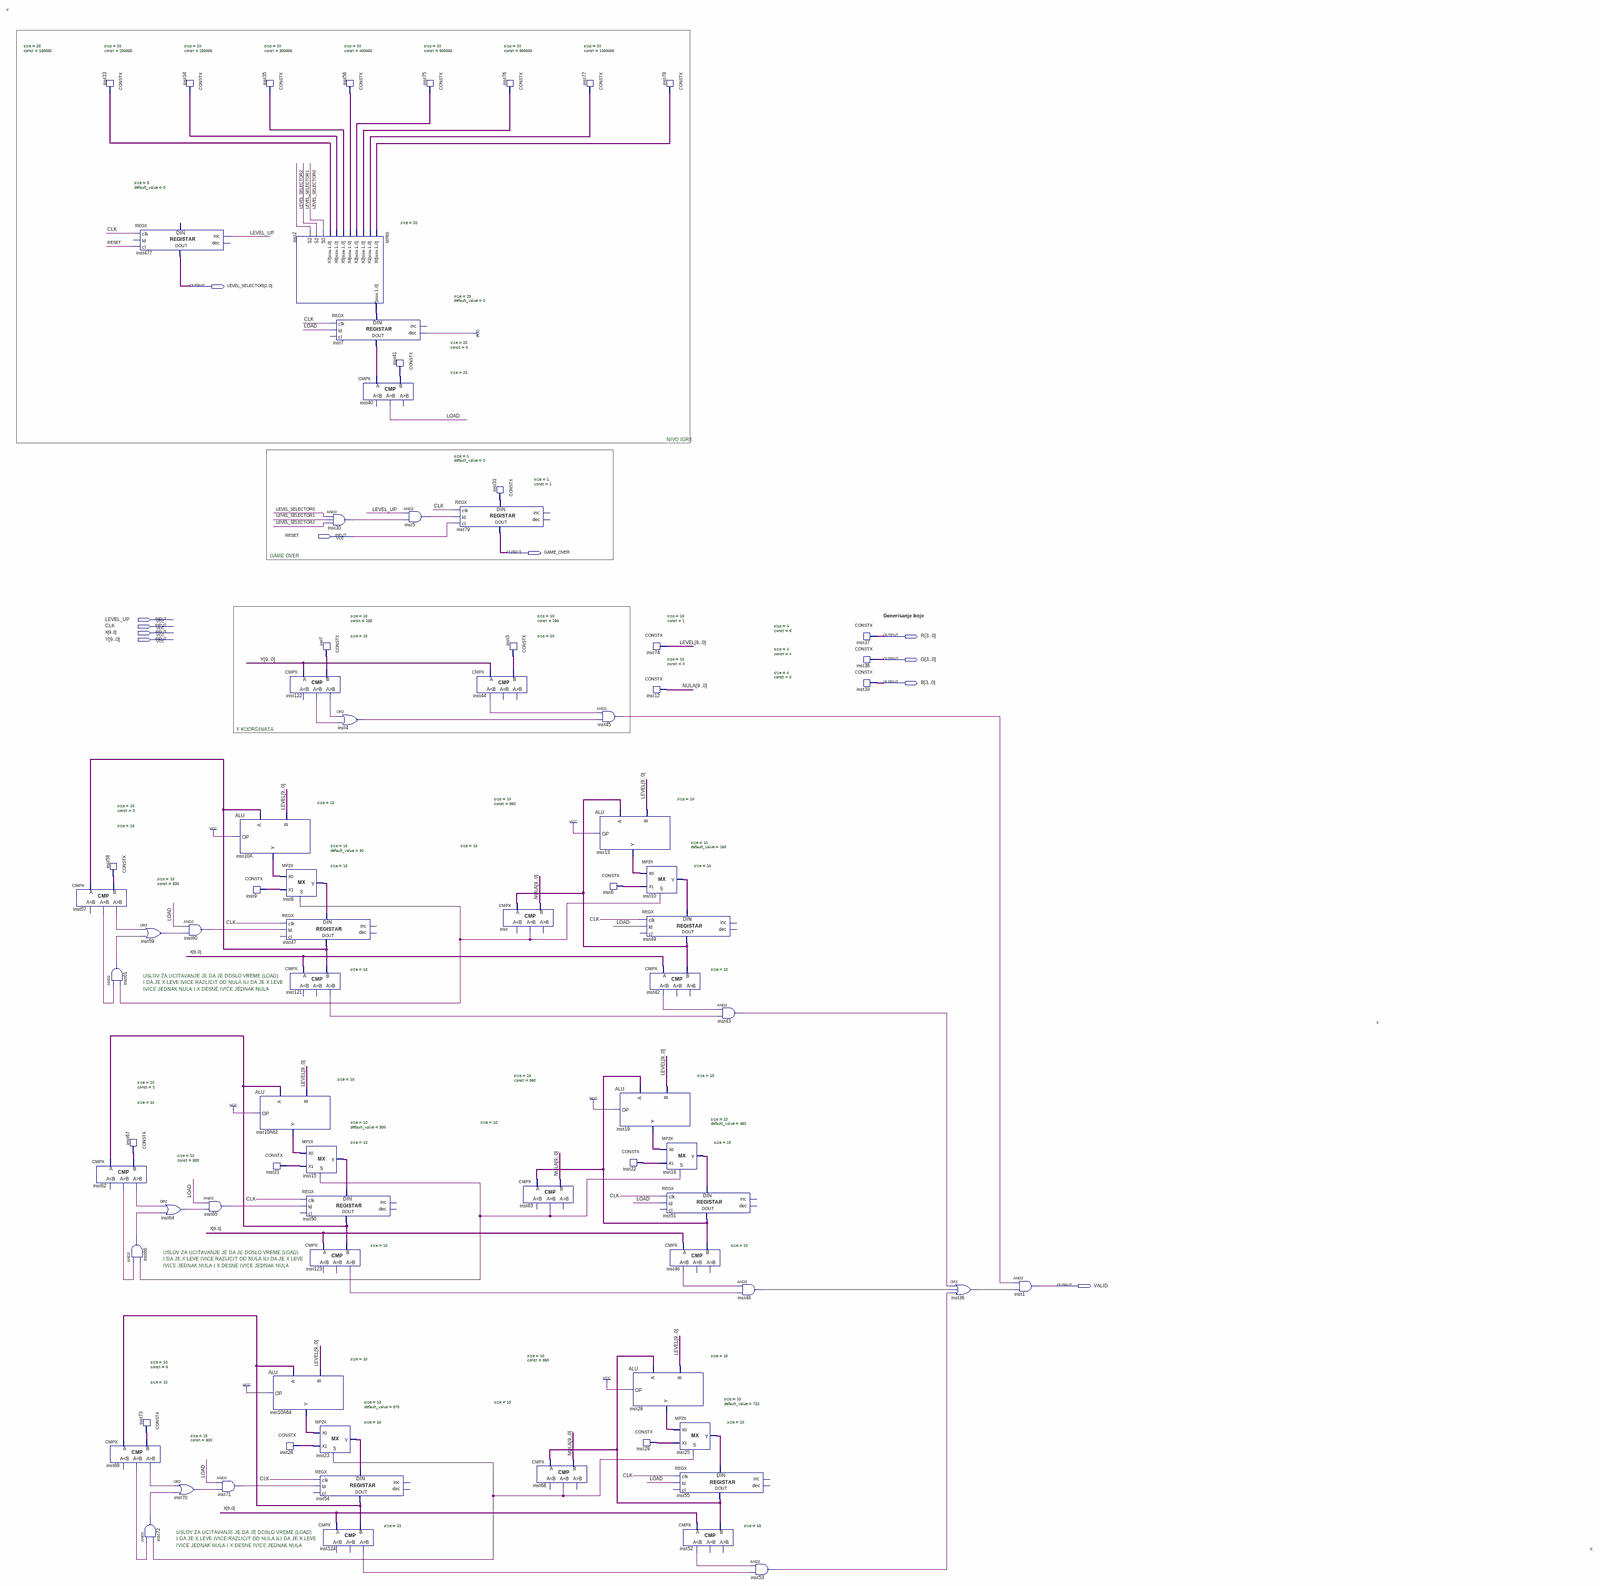
[diagram p0: schematic sheet, whole]
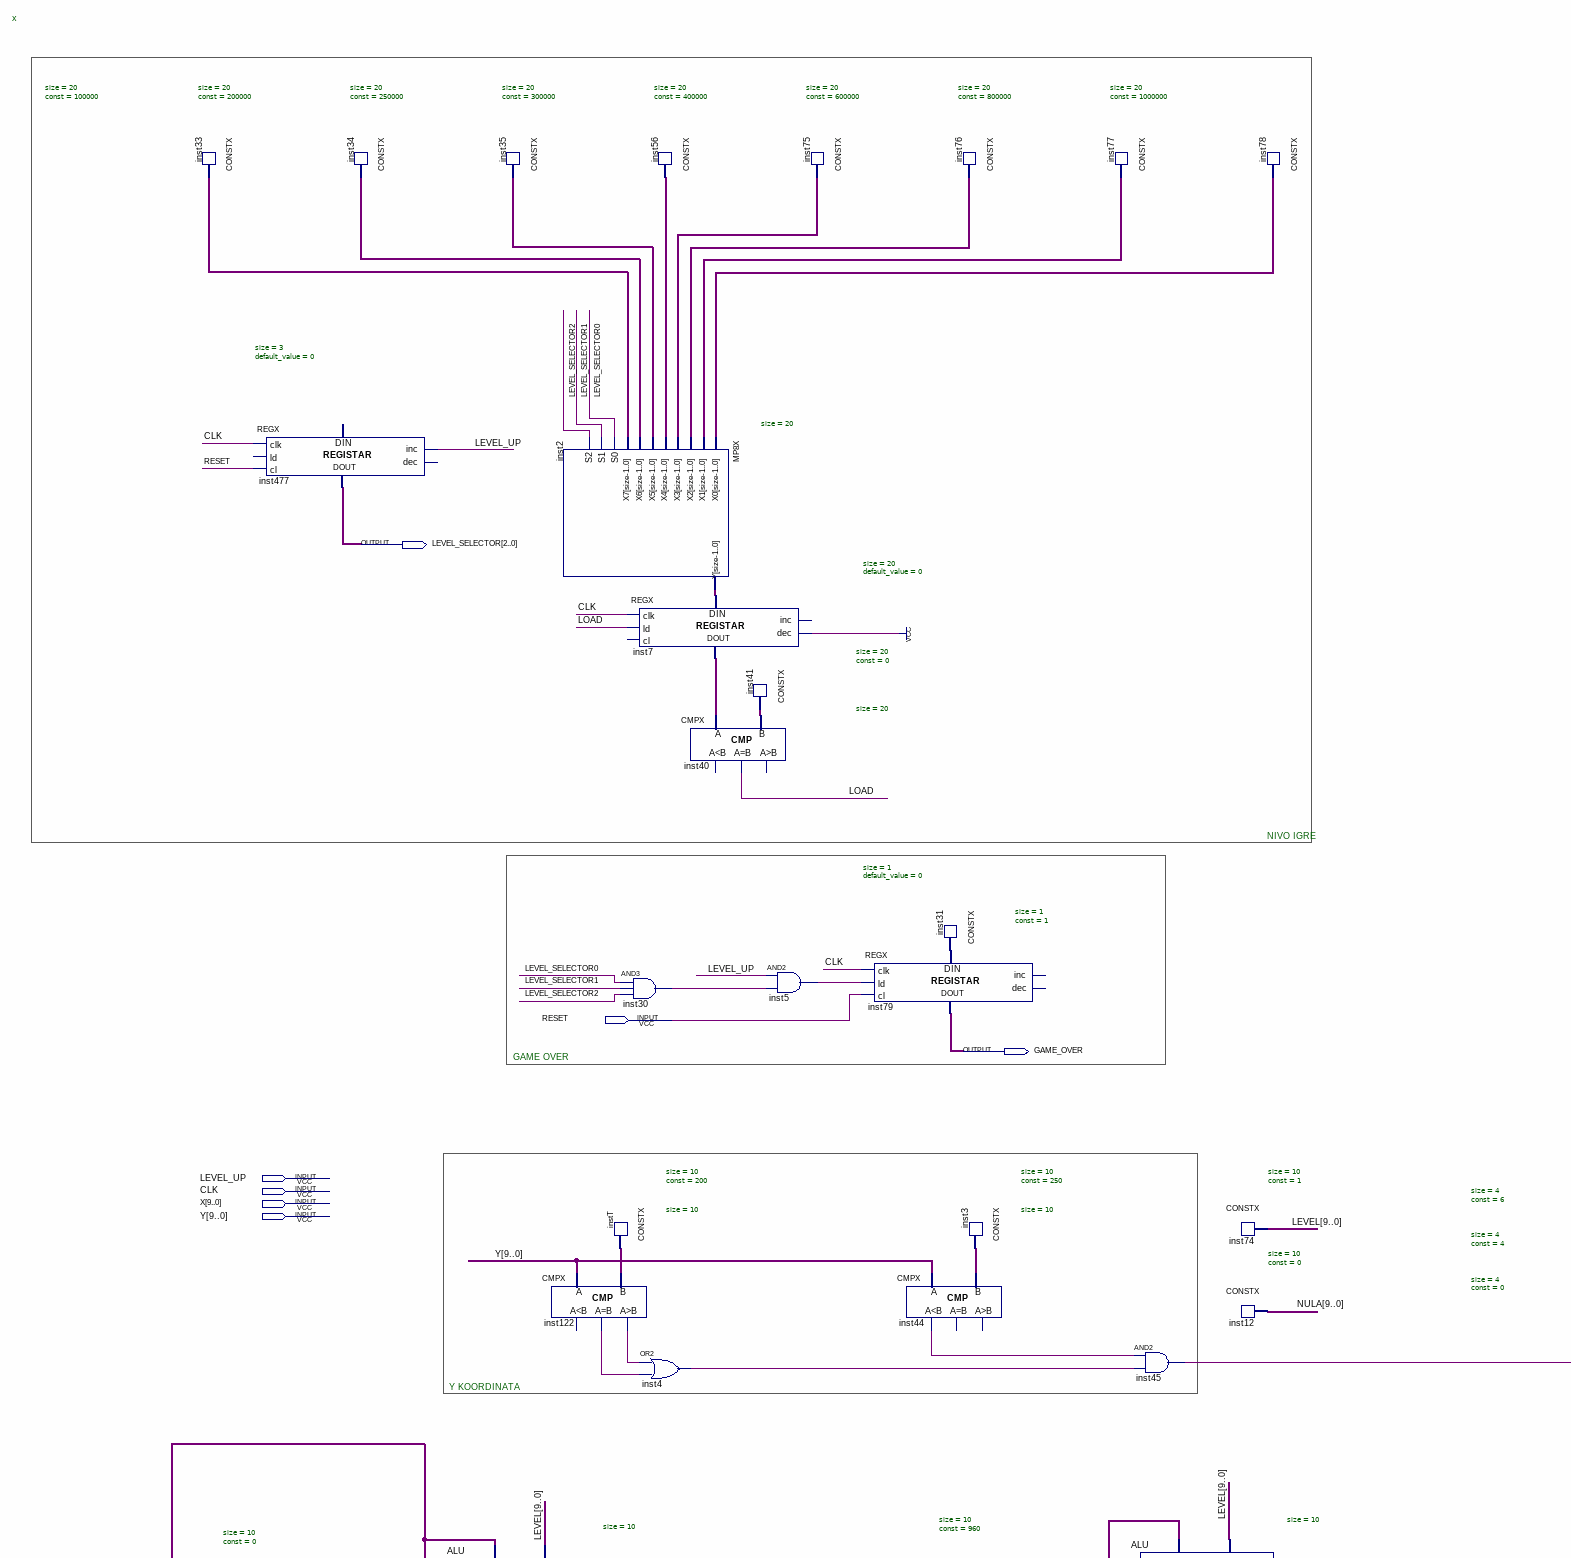
[diagram p1: schematic sheet, upper left part]
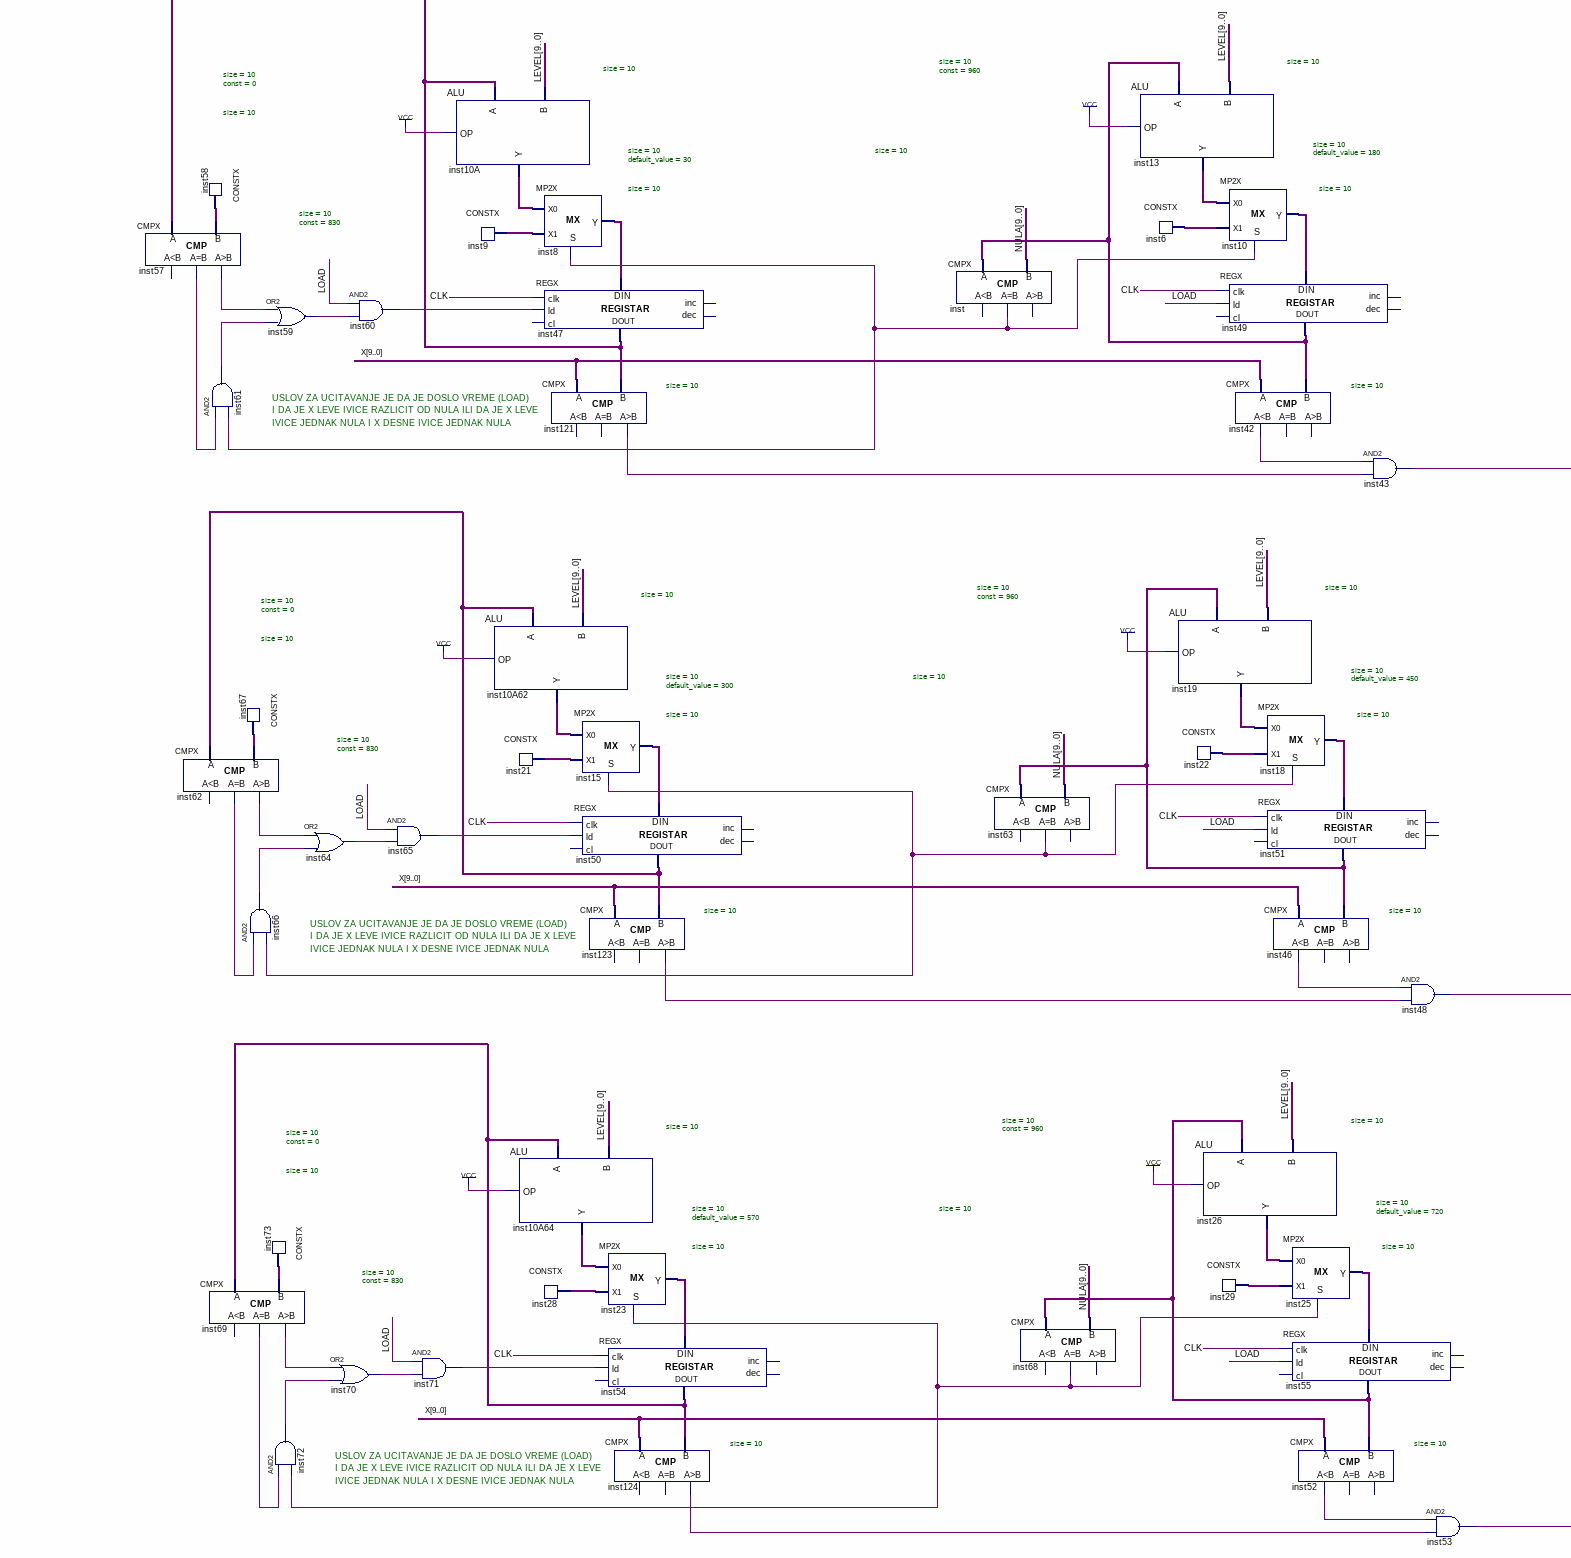
[diagram p2: schematic sheet, lower left part]
// Quartus schematic Layer_Road.bdf as structural Verilog: 81 symbols, 11 pins
module Layer_Road (
  input  RESET,
  input  LEVEL_UP,
  input  CLK,
  input  [9:0] X,
  input  [9:0] Y,
  output [2:0] LEVEL_SELECTOR,
  output GAME_OVER,
  output [3:0] R,
  output [3:0] G,
  output [3:0] B,
  output VALID
);

  wire inst4_out, inst5_out, inst30_out, inst31_data, inst36_out, inst42_ls, inst43_out, inst44_ls,
       inst45_out, inst46_ls, inst48_out, inst52_ls, inst53_out, inst57_eq, inst57_gr, inst59_out,
       inst60_out, inst61_out, inst62_eq, inst62_gr, inst63_eq, inst64_out, inst65_out, inst66_out,
       inst68_eq, inst69_eq, inst69_gr, inst70_out, inst71_out, inst72_out, inst121_gr, inst122_eq,
       inst122_gr, inst123_gr, inst124_gr, inst_eq, LOAD;
  wire [9:0] inst3_data, inst6_data, inst8_y, inst9_data, inst10_y, inst10A62_result, inst10A64_result,
       inst10A_result, inst13_result, inst15_y, inst18_y, inst19_result, inst21_data, inst22_data, inst23_y,
       inst25_y, inst26_result, inst28_data, inst29_data, inst47_data_out, inst49_data_out, inst50_data_out,
       inst51_data_out, inst54_data_out, inst55_data_out, inst58_data, inst67_data, inst73_data, instT_data,
       LEVEL, NULA;
  wire [19:0] inst2_y, inst7_data_out, inst33_data, inst34_data, inst35_data, inst41_data, inst56_data,
       inst75_data, inst76_data, inst77_data, inst78_data;

  CMPX #(.size(10)) inst57 (.A(inst47_data_out), .B(inst58_data), .eq(inst57_eq), .gr(inst57_gr));  // open: ls
  CONSTX #(.size(20), .\const (100000)) inst33 (.data(inst33_data));
  CONSTX #(.size(10), .\const (0)) inst58 (.data(inst58_data));
  CMPX #(.size(10)) inst62 (.A(inst50_data_out), .B(inst67_data), .eq(inst62_eq), .gr(inst62_gr));  // open: ls
  CMPX #(.size(10)) inst69 (.A(inst54_data_out), .B(inst73_data), .eq(inst69_eq), .gr(inst69_gr));  // open: ls
  and inst61 (inst61_out, inst57_eq, inst_eq);
  CONSTX #(.size(10), .\const (0)) inst67 (.data(inst67_data));
  and inst66 (inst66_out, inst62_eq, inst63_eq);
  REGX #(.size(3), .default_value(0)) inst477 (
    .clk(CLK), .cl(RESET), .inc(LEVEL_UP), .data_out(LEVEL_SELECTOR));  // open: ld, dec, data_in
  or inst59 (inst59_out, inst57_gr, inst61_out);
  CONSTX #(.size(10), .\const (0)) inst73 (.data(inst73_data));
  and inst72 (inst72_out, inst69_eq, inst68_eq);
  CONSTX #(.size(20), .\const (200000)) inst34 (.data(inst34_data));
  and inst60 (inst60_out, LOAD, inst59_out);
  or inst64 (inst64_out, inst62_gr, inst66_out);
  or inst70 (inst70_out, inst69_gr, inst72_out);
  and inst65 (inst65_out, LOAD, inst64_out);
  ALU #(.size(10)) inst10A (.op(1'b1), .a(inst47_data_out), .b(LEVEL), .result(inst10A_result));
  and inst71 (inst71_out, LOAD, inst70_out);
  CONSTX #(.size(20), .\const (250000)) inst35 (.data(inst35_data));
  CONSTX #(.size(10), .\const (830)) inst9 (.data(inst9_data));
  ALU #(.size(10)) inst10A62 (.op(1'b1), .a(inst50_data_out), .b(LEVEL), .result(inst10A62_result));
  CONSTX #(.size(10), .\const (830)) inst21 (.data(inst21_data));
  MP8X #(.size(20)) inst2 (
    .X0(inst78_data), .X1(inst77_data), .X2(inst76_data), .X3(inst75_data), .X4(inst56_data),
    .X5(inst35_data), .X6(inst34_data), .X7(inst33_data), .S0(LEVEL_SELECTOR[0]), .S1(LEVEL_SELECTOR[1]),
    .S2(LEVEL_SELECTOR[2]), .Y(inst2_y));
  CMPX #(.size(10)) inst122 (.A(Y), .B(instT_data), .eq(inst122_eq), .gr(inst122_gr));  // open: ls
  MP2X #(.size(10)) inst8 (.S(inst_eq), .X0(inst10A_result), .X1(inst9_data), .Y(inst8_y));
  REGX #(.size(10), .default_value(30)) inst47 (
    .clk(CLK), .ld(inst60_out), .data_in(inst8_y), .data_out(inst47_data_out));  // open: cl, inc, dec
  CMPX #(.size(10)) inst121 (.A(X), .B(inst47_data_out), .gr(inst121_gr));  // open: ls, eq
  ALU #(.size(10)) inst10A64 (.op(1'b1), .a(inst54_data_out), .b(LEVEL), .result(inst10A64_result));
  CONSTX #(.size(10), .\const (830)) inst28 (.data(inst28_data));
  CONSTX #(.size(10), .\const (200)) instT (.data(instT_data));
  MP2X #(.size(10)) inst15 (.S(inst63_eq), .X0(inst10A62_result), .X1(inst21_data), .Y(inst15_y));
  REGX #(.size(10), .default_value(300)) inst50 (
    .clk(CLK), .ld(inst65_out), .data_in(inst15_y), .data_out(inst50_data_out));  // open: cl, inc, dec
  CMPX #(.size(10)) inst123 (.A(X), .B(inst50_data_out), .gr(inst123_gr));  // open: ls, eq
  MP2X #(.size(10)) inst23 (.S(inst68_eq), .X0(inst10A64_result), .X1(inst28_data), .Y(inst23_y));
  REGX #(.size(10), .default_value(570)) inst54 (
    .clk(CLK), .ld(inst71_out), .data_in(inst23_y), .data_out(inst54_data_out));  // open: cl, inc, dec
  CMPX #(.size(10)) inst124 (.A(X), .B(inst54_data_out), .gr(inst124_gr));  // open: ls, eq
  CONSTX #(.size(20), .\const (300000)) inst56 (.data(inst56_data));
  REGX #(.size(20), .default_value(0)) inst7 (
    .clk(CLK), .ld(LOAD), .dec(1'b1), .data_in(inst2_y), .data_out(inst7_data_out));  // open: cl, inc
  and inst30 (inst30_out, LEVEL_SELECTOR[0], LEVEL_SELECTOR[1], LEVEL_SELECTOR[2]);
  or inst4 (inst4_out, inst122_gr, inst122_eq);
  CMPX #(.size(20)) inst40 (.A(inst7_data_out), .B(inst41_data), .eq(LOAD));  // open: ls, gr
  CONSTX #(.size(20), .\const (0)) inst41 (.data(inst41_data));
  CONSTX #(.size(20), .\const (400000)) inst75 (.data(inst75_data));
  and inst5 (inst5_out, LEVEL_UP, inst30_out);
  REGX #(.size(1), .default_value(0)) inst79 (
    .clk(CLK), .ld(inst5_out), .cl(RESET), .data_in(inst31_data), .data_out(GAME_OVER));  // open: inc, dec
  CMPX #(.size(10)) inst44 (.A(Y), .B(inst3_data), .ls(inst44_ls));  // open: eq, gr
  CONSTX #(.size(20), .\const (600000)) inst76 (.data(inst76_data));
  CONSTX #(.size(1), .\const (1)) inst31 (.data(inst31_data));
  CONSTX #(.size(10), .\const (250)) inst3 (.data(inst3_data));
  CMPX #(.size(10)) inst (.A(inst49_data_out), .B(NULA), .eq(inst_eq));  // open: ls, gr
  CMPX #(.size(10)) inst63 (.A(inst51_data_out), .B(NULA), .eq(inst63_eq));  // open: ls, gr
  CMPX #(.size(10)) inst68 (.A(inst55_data_out), .B(NULA), .eq(inst68_eq));  // open: ls, gr
  CONSTX #(.size(20), .\const (800000)) inst77 (.data(inst77_data));
  and inst45 (inst45_out, inst44_ls, inst4_out);
  ALU #(.size(10)) inst13 (.op(1'b1), .a(inst49_data_out), .b(LEVEL), .result(inst13_result));
  CONSTX #(.size(10), .\const (960)) inst6 (.data(inst6_data));
  ALU #(.size(10)) inst19 (.op(1'b1), .a(inst51_data_out), .b(LEVEL), .result(inst19_result));
  CONSTX #(.size(10), .\const (960)) inst22 (.data(inst22_data));
  ALU #(.size(10)) inst26 (.op(1'b1), .a(inst55_data_out), .b(LEVEL), .result(inst26_result));
  CONSTX #(.size(10), .\const (960)) inst29 (.data(inst29_data));
  CONSTX #(.size(20), .\const (1000000)) inst78 (.data(inst78_data));
  CONSTX #(.size(10), .\const (1)) inst74 (.data(LEVEL));
  CONSTX #(.size(10), .\const (0)) inst12 (.data(NULA));
  MP2X #(.size(10)) inst10 (.S(inst_eq), .X0(inst13_result), .X1(inst6_data), .Y(inst10_y));
  REGX #(.size(10), .default_value(180)) inst49 (
    .clk(CLK), .ld(LOAD), .data_in(inst10_y), .data_out(inst49_data_out));  // open: cl, inc, dec
  CMPX #(.size(10)) inst42 (.A(X), .B(inst49_data_out), .ls(inst42_ls));  // open: eq, gr
  MP2X #(.size(10)) inst18 (.S(inst63_eq), .X0(inst19_result), .X1(inst22_data), .Y(inst18_y));
  REGX #(.size(10), .default_value(450)) inst51 (
    .clk(CLK), .ld(LOAD), .data_in(inst18_y), .data_out(inst51_data_out));  // open: cl, inc, dec
  CMPX #(.size(10)) inst46 (.A(X), .B(inst51_data_out), .ls(inst46_ls));  // open: eq, gr
  MP2X #(.size(10)) inst25 (.S(inst68_eq), .X0(inst26_result), .X1(inst29_data), .Y(inst25_y));
  REGX #(.size(10), .default_value(720)) inst55 (
    .clk(CLK), .ld(LOAD), .data_in(inst25_y), .data_out(inst55_data_out));  // open: cl, inc, dec
  CMPX #(.size(10)) inst52 (.A(X), .B(inst55_data_out), .ls(inst52_ls));  // open: eq, gr
  and inst43 (inst43_out, inst42_ls, inst121_gr);
  and inst48 (inst48_out, inst46_ls, inst123_gr);
  and inst53 (inst53_out, inst52_ls, inst124_gr);
  CONSTX #(.size(4), .\const (6)) inst37 (.data(R));
  CONSTX #(.size(4), .\const (4)) inst38 (.data(G));
  CONSTX #(.size(4), .\const (0)) inst39 (.data(B));
  or inst36 (inst36_out, inst43_out, inst48_out, inst53_out);
  and inst1 (VALID, inst45_out, inst36_out);

  // Notes on the sheet:
  //   x
  //   NIVO IGRE
  //   GAME OVER
  //   Generisanje boje
  //   Y KOORDINATA
  //   USLOV ZA UCITAVANJE JE DA JE DOSLO VREME (LOAD)
  //   I DA JE X LEVE IVICE RAZLICIT OD NULA ILI DA JE X LEVE
  //   IVICE JEDNAK NULA I X DESNE IVICE JEDNAK NULA
  //   x
  //   USLOV ZA UCITAVANJE JE DA JE DOSLO VREME (LOAD)
  //   I DA JE X LEVE IVICE RAZLICIT OD NULA ILI DA JE X LEVE
  //   IVICE JEDNAK NULA I X DESNE IVICE JEDNAK NULA
  //   USLOV ZA UCITAVANJE JE DA JE DOSLO VREME (LOAD)
  //   I DA JE X LEVE IVICE RAZLICIT OD NULA ILI DA JE X LEVE
  //   IVICE JEDNAK NULA I X DESNE IVICE JEDNAK NULA
  //   x
endmodule
